# EAGLE board SniperBoard (EAGLE 6.4)
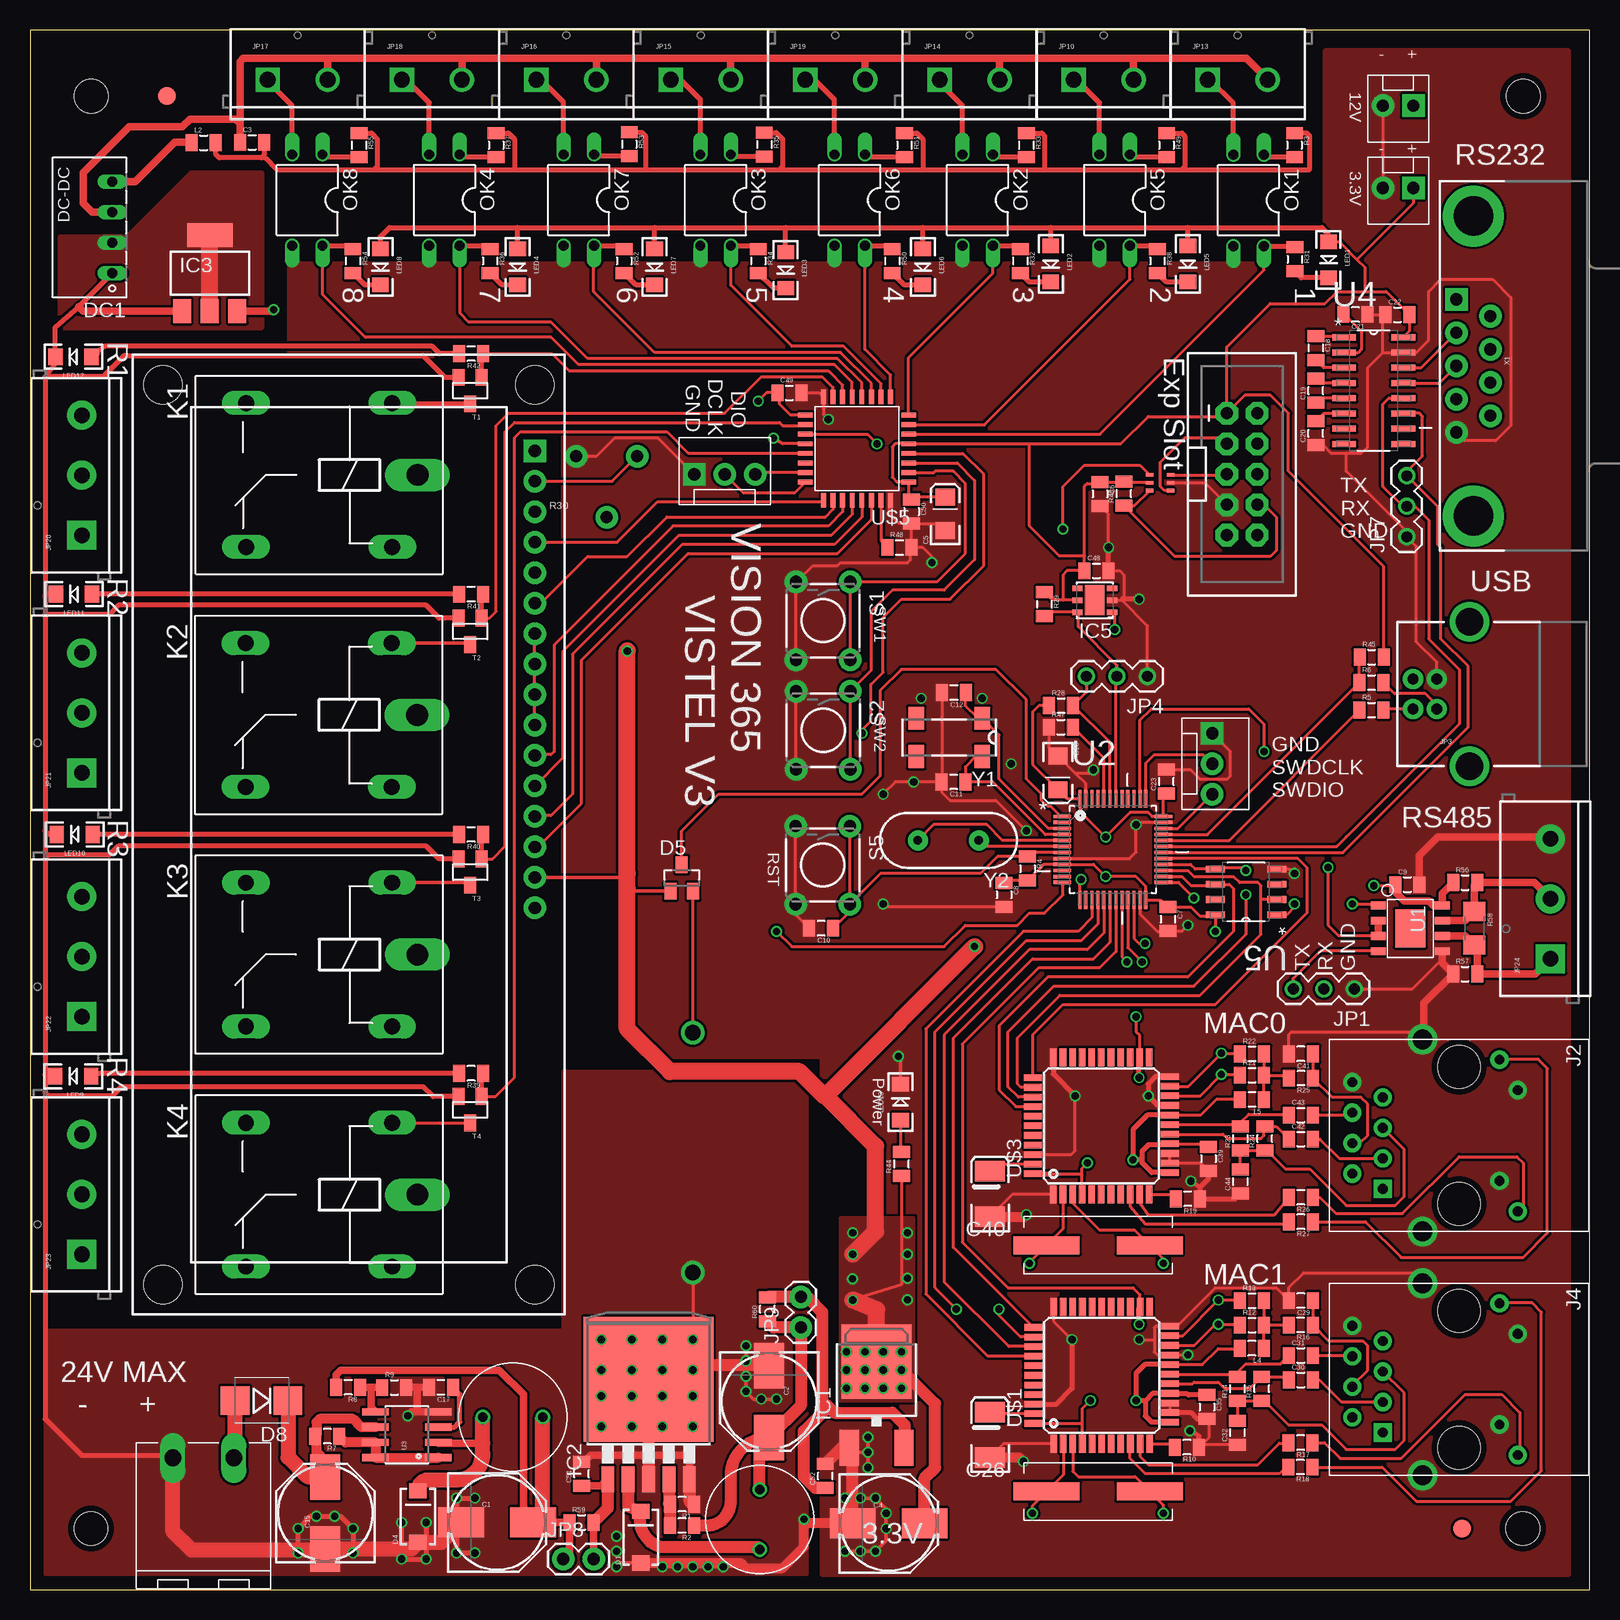
[diagram p5: board, top side]
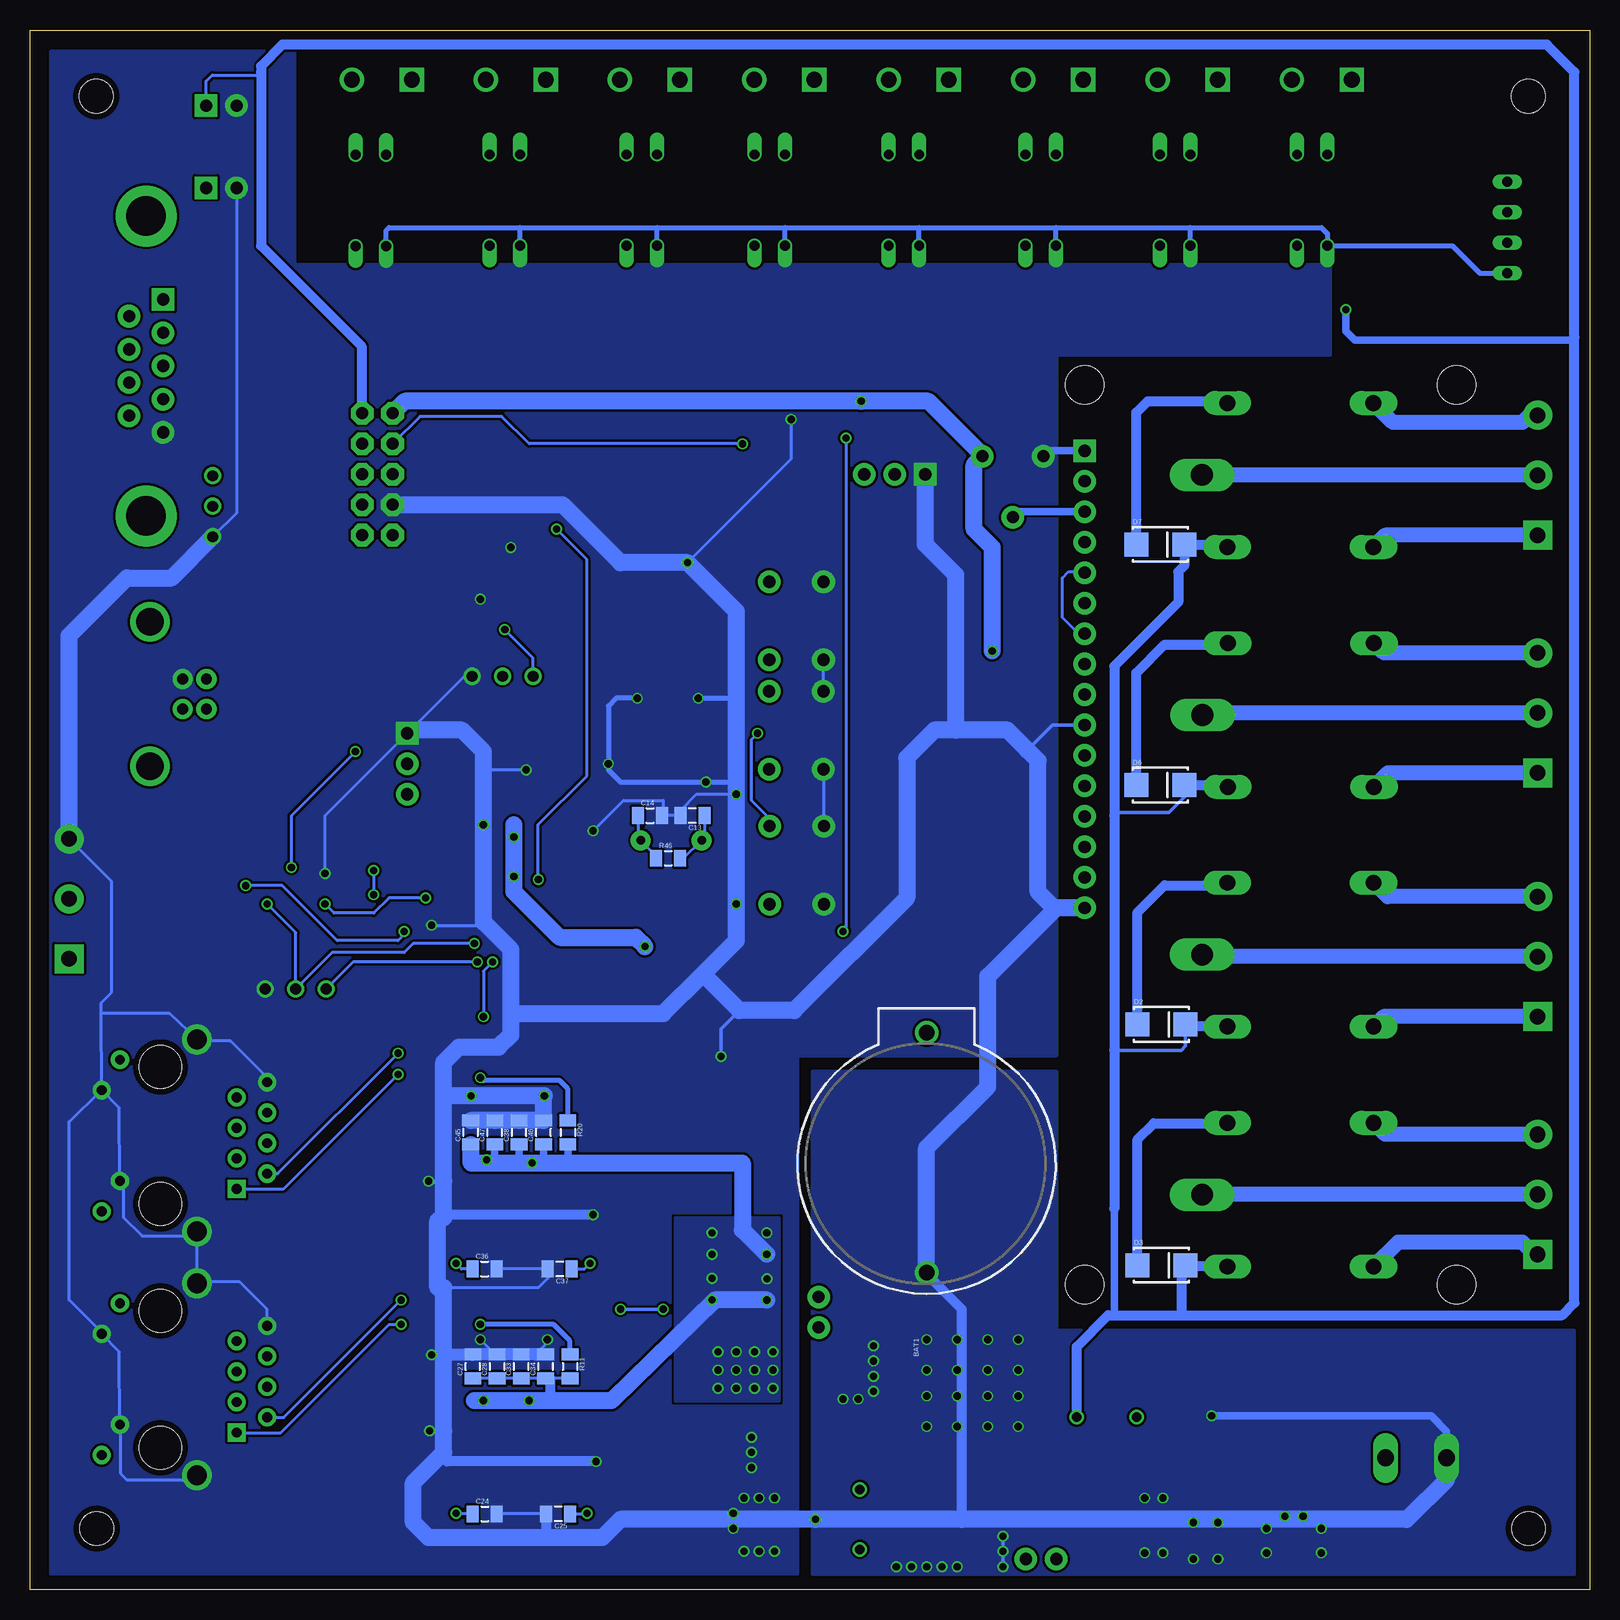
[diagram p6: board, bottom side, seen from below]

Size 130 x 130 mm. Coordinates in mm from the lower left corner, seen from the top.
Outline: 0,0 130,0 130,130 0,130 0,0
Copper layers (1*16): Top 0.035mm / dielectric 1.6mm / Bottom 0.035mm
Design rules "Elecrow_2-layer_PCB_eagle_rule *": minimum track width 8mil, minimum drill 12mil, track to track 8mil, track to pad 8mil, pad to pad 8mil, via to via 8mil, smd to smd 8mil, copper to edge 20mil, drill to drill 10mil, minimum pad ring 6mil, minimum via ring 6mil, stop-mask expansion 0mil, vias tented up to drill 100mil, thermal gap 10mil
Holes 2.8 mm at 5.1,124.49 124.47,124.49 124.43,5.08 5.08,5.08

## Footprints (pad centres in the part's own frame; a part is rotated, then mirrored left to right if it is on the bottom)
BATTCOM_20MM_PTH = drill 1.3: 1 20,0; 2 0,0
PANASONIC_E = smd 3.8 x 2.5: + 3,0; - -3,0
0805 = smd 1 x 1.4: 1 -1,0; 2 1,0
EIA3216 = smd 1.4 x 1.6: A 1.4,0; C -1.4,0
EIA3528-KIT = smd 1.7 x 2.5: A 1.9,0; C -1.9,0
SMA-DIODE = smd 1.27 x 1.47: A -2.15,0; C 2.15,0
SMA-DIODE_ALT = smd 2 x 2: A -2,0; C 2,0
SOT23 = smd 1 x 1.4: 1 -0.95,-1.1; 2 0.95,-1.1; 3 0,1.1
SMB-DIODE = smd 2.4 x 2.4: A 2.2,0; C -2.2,0
NME = drill 0.813 long: 1 0,3.81; 2 0,1.27; 3 0,-1.27; 4 0,-3.81
FIDUCIAL-1.5X3 = smd 1.5 x 1.5: 1 0,0
DPACK = smd 1.6 x 3: 1 -2.28,-4.8; 3 2.28,-4.8 | smd 5.8 x 6.2: 4 0,2.38
TO263-5 = smd 1.067 x 2.159: 1 -3.404,-5.791; 2 -1.702,-5.791; 3 0,-5.791; 4 1.702,-5.791; 5 3.404,-5.791 | smd 10.8 x 10.41: 6 0,2.54
SOT223 = smd 1.5 x 2: 1 -2.3,-3.15; 2 0,-3.15; 3 2.3,-3.15 | smd 3.8 x 2: 4 0,3.15
DFN6-3X3 = smd 0.85 x 0.45: 1 -1.45,1; 2 -1.45,0; 3 -1.45,-1; 4 1.45,-1; 5 1.45,0; 6 1.45,1 | smd 1.6 x 2.5: EXP 0,0
RJMG1BD3B8K1ANR = drill 0.813 pad 1.524: G+ 4.9,-6.32; G- 3.38,-3.78; GND -8.89,4.445; NC -6.35,3.175; P4 -8.89,-0.635; P5 -6.35,0.635; RD+ -6.35,-1.905; RD- -8.89,1.905; TD- -8.89,-3.175; Y+ 3.38,6.32; Y- 4.9,3.78 | drill 1.651 pad 2.159: SHIELD0 -3.05,8.001; SHIELD1 -3.05,-8.001 | drill 0.813 pad 1.524 square: TD+ -6.35,-4.445 | hole 3.556: 0,-5.715; 0,5.715
1X03 = drill 0.9 pad 1.422: 1 0,0; 2 2.54,0; 3 5.08,0
MOLEX-1X3 = drill 1.016 pad 1.88 square: 1 0,0 | drill 1.016 pad 1.88: 2 2.54,0; 3 5.08,0
USB-B-PTH = drill 0.914 pad 1.676: D+ 0,1.25; D- 1.981,1.25; GND 0,-1.25; VBUS 1.981,-1.25 | drill 2.286: S1 -2.718,-6.02; S2 -2.718,6.02
MOLEX-1X2 = drill 1.016 pad 1.88 square: 1 0,0 | drill 1.016 pad 1.88: 2 2.54,0
1X02 = drill 1.016 pad 1.88: 1 0,0; 2 2.54,0
SCREWTERMINAL-5MM-2 = drill 1.3 pad 2.032 square: 1 0,0 | drill 1.3 pad 2.032: 2 5,0
2X5-SHROUDED = drill 1.016 pad 1.88 octagon: 1 -1.27,5.08; 2 1.27,5.08; 3 -1.27,2.54; 4 1.27,2.54; 5 -1.27,0; 6 1.27,0; 7 -1.27,-2.54; 8 1.27,-2.54; 9 -1.27,-5.08; 10 1.27,-5.08
SCREWTERMINAL-5MM-3 = drill 1.3 pad 2.413 square: 1 0,0 | drill 1.3 pad 2.413: 2 5,0; 3 10,0
ZF112 = drill 1.321 long: 1 -6.096,5.994; 2 -6.096,-5.994; O 6.096,5.994; S 6.096,-5.994 | drill 1.803 long: P -8.204,0
RLB914-IND = drill 0.8: P$1 -2.5,0; P$2 2.5,0
LED-1206 = smd 1.2 x 1.4: A -1.5,0; C 1.5,0
DIL04 = drill 0.813 offset: 1 -1.27,-3.81; 2 1.27,-3.81; 3 1.27,3.81; 4 -1.27,3.81
TRIM_POT_PTH = drill 1 pad 1.88: 1 -2.54,-2.54; 2 0,2.54; 3 2.54,-2.54
1206 = smd 1.6 x 1.8: 1 -1.4,0; 2 1.4,0
TACTILE-PTH = drill 1.016 pad 1.88: 1 -3.251,2.261; 2 3.251,2.261; 3 -3.251,-2.261; 4 3.251,-2.261
SOP8 = smd 0.635 x 1.27: 1 -1.905,-2.667; 2 -0.635,-2.667; 3 0.635,-2.667; 4 1.905,-2.667; 5 1.905,2.667; 6 0.635,2.667; 7 -0.635,2.667; 8 -1.905,2.667 | smd 3.175 x 2.54: HEAT 0,0
QFP50P900X900X160-48N = smd 1.473 x 0.279: 1 -4.216,2.743; 2 -4.216,2.261; 3 -4.216,1.753; 4 -4.216,1.245; 5 -4.216,0.762; 6 -4.216,0.254; 7 -4.216,-0.254; 8 -4.216,-0.762; 9 -4.216,-1.245; 10 -4.216,-1.753; 11 -4.216,-2.261; 12 -4.216,-2.743; 25 4.216,-2.743; 26 4.216,-2.261; 27 4.216,-1.753; 28 4.216,-1.245; 29 4.216,-0.762; 30 4.216,-0.254; 31 4.216,0.254; 32 4.216,0.762; 33 4.216,1.245; 34 4.216,1.753; 35 4.216,2.261; 36 4.216,2.743 | smd 0.279 x 1.473: 13 -2.743,-4.216; 14 -2.261,-4.216; 15 -1.753,-4.216; 16 -1.245,-4.216; 17 -0.762,-4.216; 18 -0.254,-4.216; 19 0.254,-4.216; 20 0.762,-4.216; 21 1.245,-4.216; 22 1.753,-4.216; 23 2.261,-4.216; 24 2.743,-4.216; 37 2.743,4.216; 38 2.261,4.216; 39 1.753,4.216; 40 1.245,4.216; 41 0.762,4.216; 42 0.254,4.216; 43 -0.254,4.216; 44 -0.762,4.216; 45 -1.245,4.216; 46 -1.753,4.216; 47 -2.261,4.216; 48 -2.743,4.216
SO08 = smd 0.61 x 2.21: 1 -1.905,-2.616; 2 -0.635,-2.616; 3 0.635,-2.616; 4 1.905,-2.616; 5 1.905,2.616; 6 0.635,2.616; 7 -0.635,2.616; 8 -1.905,2.616
SOIC127P600X175-16N = smd 1.981 x 0.508: 1 -2.464,4.445; 2 -2.464,3.175; 3 -2.464,1.905; 4 -2.464,0.635; 5 -2.464,-0.635; 6 -2.464,-1.905; 7 -2.464,-3.175; 8 -2.464,-4.445; 9 2.464,-4.445; 10 2.464,-3.175; 11 2.464,-1.905; 12 2.464,-0.635; 13 2.464,0.635; 14 2.464,1.905; 15 2.464,3.175; 16 2.464,4.445
SOIC127P600X175-8N = smd 1.6 x 0.559: 1 -2.565,1.905; 2 -2.565,0.635; 3 -2.565,-0.635; 4 -2.565,-1.905; 5 2.565,-1.905; 6 2.565,-0.635; 7 2.565,0.635; 8 2.565,1.905
LCD-16X2 = drill 1.016 pad 1.88 square: 1 -32,15.5 | drill 1.016 pad 1.88: 2 -29.46,15.5; 3 -26.92,15.5; 4 -24.38,15.5; 5 -21.84,15.5; 6 -19.3,15.5; 7 -16.76,15.5; 8 -14.22,15.5; 9 -11.68,15.5; 10 -9.14,15.5; 11 -6.6,15.5; 12 -4.06,15.5; 13 -1.52,15.5; 14 1.02,15.5; 15 3.56,15.5; 16 6.1,15.5 | hole 3.2: -37.5,15.5; -37.5,-15.5; 37.5,15.5; 37.5,-15.5
TQFP-44 = smd 1.5 x 0.55: 1 -5.7,4; 2 -5.7,3.2; 3 -5.7,2.4; 4 -5.7,1.6; 5 -5.7,0.8; 6 -5.7,0; 7 -5.7,-0.8; 8 -5.7,-1.6; 9 -5.7,-2.4; 10 -5.7,-3.2; 11 -5.7,-4; 23 5.7,-4; 24 5.7,-3.2; 25 5.7,-2.4; 26 5.7,-1.6; 27 5.7,-0.8; 28 5.7,0; 29 5.7,0.8; 30 5.7,1.6; 31 5.7,2.4; 32 5.7,3.2; 33 5.7,4 | smd 0.55 x 1.5: 12 -3.9,-5.7; 13 -3.1,-5.7; 14 -2.3,-5.7; 15 -1.5,-5.7; 16 -0.7,-5.7; 17 0.1,-5.7; 18 0.9,-5.7; 19 1.7,-5.7; 20 2.5,-5.7; 21 3.3,-5.7; 22 4.1,-5.7; 34 4,5.7; 35 3.2,5.7; 36 2.4,5.7; 37 1.6,5.7; 38 0.8,5.7; 39 0,5.7; 40 -0.8,5.7; 41 -1.6,5.7; 42 -2.4,5.7; 43 -3.2,5.7; 44 -4,5.7
1X02_TERMB_RA = drill 1.4 long: P$1 0,2.54; P$2 0,-2.54
SC70-6 = smd 0.61 x 0.305: P$1 -0.85,0; P$2 0.9,0; P$3 0.9,-0.65; P$4 -0.85,-0.65; P$5 -0.85,-1.3; P$6 0.9,-1.3
LQFP32-7X7 = smd 1.2 x 0.4: 1 -4.3,2.8; 2 -4.3,2; 3 -4.3,1.2; 4 -4.3,0.4; 5 -4.3,-0.4; 6 -4.3,-1.2; 7 -4.3,-2; 8 -4.3,-2.8; 17 4.3,-2.8; 18 4.3,-2; 19 4.3,-1.2; 20 4.3,-0.4; 21 4.3,0.4; 22 4.3,1.2; 23 4.3,2; 24 4.3,2.8 | smd 0.4 x 1.2: 9 -2.8,-4.3; 10 -2,-4.3; 11 -1.2,-4.3; 12 -0.4,-4.3; 13 0.4,-4.3; 14 1.2,-4.3; 15 2,-4.3; 16 2.8,-4.3; 25 2.8,4.3; 26 2,4.3; 27 1.2,4.3; 28 0.4,4.3; 29 -0.4,4.3; 30 -1.2,4.3; 31 -2,4.3; 32 -2.8,4.3
DB9 = drill 1.016 pad 1.88 square: 1 -5.54,-1.42 | drill 1.016 pad 1.88: 2 -2.77,-1.42; 3 0,-1.42; 4 2.77,-1.42; 5 5.54,-1.42; 6 -4.15,1.42; 7 -1.38,1.42; 8 1.38,1.42; 9 4.15,1.42 | drill 3.302 pad 5.08: G1 -12.5,0; G2 12.5,0
MC-306 = smd 1.3 x 1.9: 1 -2.75,-1.6; 2 2.75,-1.6; 3 2.75,1.6; 4 -2.75,1.6
HC49US = drill 0.7 pad 1.651: 1 -2.54,0; 2 2.54,0
CRYSTAL-SMD-10.5X4.8-2PIN = smd 5.5 x 1.5: P$1 -4.3,0; P$2 4.3,0

## Placement (x,y rotation side)
BAT1  3V  [BATTCOM_20MM_PTH]  55.26,26.42 90 bottom
C1  100uF  [PANASONIC_E]  38.94,5.59 0 top
C2  470uF  [PANASONIC_E]  61.61,15.67 270 top
C3  0.1uF  [0805]  18.52,120.62 0 top
C4  470uF  [PANASONIC_E]  71.57,5.51 0 top
C5  10uF  [EIA3216]  76.28,89.66 90 top
C6  0.1uF  [0805]  89.2,91.33 270 top
C7  0.1uF  [0805]  94.85,55.88 270 top
C8  0.1uF  [0805]  81.2,57.91 270 top
C9  0.1uF  [0805]  114.81,58.76 0 top
C10  0.1uF  [0805]  65.96,55.12 180 top
C11  20pF  [0805]  77,67.31 180 top
C12  20pF  [0805]  77.03,74.76 180 top
C13  27pF  [0805]  74.79,64.51 180 bottom
C14  27pF  [0805]  78.32,64.52 0 bottom
C15  100uF  [PANASONIC_E]  24.62,6.39 90 top
C16  10uF  [EIA3216]  85.68,68.07 270 top
C17  220pF  [0805]  34.25,16.84 180 top
C18  0.1uF  [0805]  107.18,103.49 270 top
C19  0.1uF  [0805]  107.18,99.93 90 top
C20  0.1uF  [0805]  107.18,96.38 90 top
C21  0.1uF  [0805]  110.48,106.28 180 top
C22  0.1uF  [0805]  113.99,106.27 0 top
C23  0.1uF  [0805]  94.73,67.35 90 top
C24  27pF  [0805]  92.09,6.3 0 bottom
C25  27pF  [0805]  85.97,6.3 180 bottom
C26  10uF  [EIA3528-KIT]  80.02,12.91 90 top
C27  0.1uF  [0805]  93.08,18.59 90 bottom
C28  0.1uF  [0805]  91.05,18.59 90 bottom
C29  0.01uF  [0805]  105.94,24.08 180 top
C30  0.01uF  [0805]  105.94,17.47 0 top
C31  0.01uF  [0805]  105.94,19.5 0 top
C32  0.01uF  [0805]  100.65,13.08 90 top
C33  0.1uF  [0805]  89.05,18.59 90 bottom
C34  0.1uF  [0805]  87.02,18.59 90 bottom
C35  0.1uF  [0805]  98.11,15.21 270 top
C36  27pF  [0805]  92.1,26.72 0 bottom
C37  27pF  [0805]  85.84,26.72 180 bottom
C38  0.1uF  [0805]  89.23,38.1 90 bottom
C39  0.1uF  [0805]  98.24,35.91 270 top
C40  10uF  [EIA3528-KIT]  80.02,32.97 90 top
C41  0.01uF  [0805]  105.94,44.65 180 top
C42  0.01uF  [0805]  105.94,37.54 0 top
C43  0.01uF  [0805]  105.94,39.55 0 top
C44  0.01uF  [0805]  100.91,34.01 90 top
C45  0.1uF  [0805]  93.26,38.1 90 bottom
C46  0.1uF  [0805]  87.19,38.1 90 bottom
C47  0.1uF  [0805]  91.26,38.1 90 bottom
C48  0.1uF  [0805]  88.9,84.92 0 top
C49  0.1uF  [0805]  63.29,99.75 0 top
C50  0.1uF  [0805]  73.49,89.86 270 top
C51  0.1uF  [0805]  45.97,9.65 90 top
C52  0.1uF  [0805]  66.29,9.46 90 top
D1  SK34  [SMA-DIODE]  50.91,4.37 90 top
D2  1N4148WS-V-GS18  [SMA-DIODE_ALT]  35.68,47.1 0 bottom
D3  1N4148WS-V-GS18  [SMA-DIODE_ALT]  35.68,27.04 0 bottom
D4  SK34  [SMA-DIODE]  32.33,6.08 90 top
D5  BAS40-05  [SOT23]  54.33,59.32 0 top
D6  1N4148WS-V-GS18  [SMA-DIODE_ALT]  35.78,67.05 0 bottom
D7  1N4148WS-V-GS18  [SMA-DIODE_ALT]  35.78,87.12 0 bottom
D8  1N5819  [SMB-DIODE]  19.3,15.75 180 top
DC1  [NME]  6.86,113.54 180 top
FID1  FIDUCIAL1.5X3  [FIDUCIAL-1.5X3]  119.38,5.08 0 top
FID2  FIDUCIAL1.5X3  [FIDUCIAL-1.5X3]  11.41,124.49 0 top
IC1  LDL117S33  [DPACK]  70.56,16.62 0 top
IC2  LM2596S  [TO263-5]  51.56,14.99 0 top
IC3  LD117AS50TR  [SOT223]  14.99,109.73 0 top
IC5  SI7006-A10-IM  [DFN6-3X3]  88.76,82.47 180 top
J2  [RJMG1BD3B8K1ANR]  119.13,37.85 0 top
J4  [RJMG1BD3B8K1ANR]  119.13,17.53 0 top
JP1  [1X03]  110.39,50.06 180 top
JP2  [MOLEX-1X3]  55.37,92.96 0 top
JP3  USB-B  [USB-B-PTH]  117.27,74.66 180 top
JP4  [1X03]  93.15,76.12 180 top
JP5  [MOLEX-1X2]  115.32,123.7 180 top
JP6  [MOLEX-1X2]  115.32,116.84 180 top
JP7  [1X03]  114.77,87.76 90 top
JP8  [1X02]  44.45,2.54 0 top
JP9  [1X02]  64.26,21.84 90 top
JP10  [SCREWTERMINAL-5MM-2]  87,125.86 0 top
JP12  M05X2SHD  [2X5-SHROUDED]  101.04,92.97 0 top
JP13  [SCREWTERMINAL-5MM-2]  98.17,125.86 0 top
JP14  [SCREWTERMINAL-5MM-2]  75.82,125.86 0 top
JP15  [SCREWTERMINAL-5MM-2]  53.42,125.86 0 top
JP16  [SCREWTERMINAL-5MM-2]  42.21,125.86 0 top
JP17  [SCREWTERMINAL-5MM-2]  19.81,125.86 0 top
JP18  [SCREWTERMINAL-5MM-2]  31.01,125.86 0 top
JP19  [SCREWTERMINAL-5MM-2]  64.62,125.86 0 top
JP20  [SCREWTERMINAL-5MM-3]  4.32,87.88 90 top
JP21  [SCREWTERMINAL-5MM-3]  4.32,68.07 90 top
JP22  [SCREWTERMINAL-5MM-3]  4.32,47.75 90 top
JP23  [SCREWTERMINAL-5MM-3]  4.32,27.94 90 top
JP24  [SCREWTERMINAL-5MM-3]  126.75,52.58 90 top
JP25  [MOLEX-1X3]  98.55,71.37 270 top
K1  ZF112  [ZF112]  24.1,92.9 180 top
K2  ZF112  [ZF112]  24.06,72.9 180 top
K3  ZF112  [ZF112]  24.09,52.93 180 top
K4  ZF112  [ZF112]  24.09,32.91 180 top
L1  220uH  [RLB914-IND]  60.82,5.85 90 top
L2  10uH  [0805]  14.48,120.6 0 top
L3  220uH  [RLB914-IND]  40.24,14.37 0 top
L4  10uH  [0805]  101.85,20.11 180 top
L5  10uH  [0805]  101.87,40.84 180 top
LED1  Green  [LED-1206]  108.24,110.85 270 top
LED2  Green  [LED-1206]  85.09,110.49 270 top
LED3  Green  [LED-1206]  62.99,109.98 270 top
LED4  Green  [LED-1206]  40.64,110.24 270 top
LED5  Green  [LED-1206]  96.52,110.49 270 top
LED6  Green  [LED-1206]  74.42,110.24 270 top
LED7  Green  [LED-1206]  52.07,110.24 270 top
LED8  Green  [LED-1206]  29.21,110.24 270 top
LED9  Green  [LED-1206]  3.6,42.79 180 top
LED10  Green  [LED-1206]  3.73,62.95 180 top
LED11  Green  [LED-1206]  3.67,82.97 180 top
LED12  Green  [LED-1206]  3.61,102.76 180 top
LED13  Green  [LED-1206]  72.56,40.64 90 top
OK1  PC817  [DIL04]  101.57,115.8 180 top
OK2  PC817  [DIL04]  78.99,115.82 180 top
OK3  PC817  [DIL04]  57.15,115.82 180 top
OK4  PC817  [DIL04]  34.54,115.82 180 top
OK5  PC817  [DIL04]  90.42,115.82 180 top
OK6  PC817  [DIL04]  68.33,115.82 180 top
OK7  PC817  [DIL04]  45.75,115.82 180 top
OK8  PC817  [DIL04]  23.11,115.82 180 top
R1  1K  [0805]  54.36,7.11 180 top
R2  2.2K  [0805]  54.36,5.33 180 top
R3  470R  [0805]  105.41,120.4 270 top
R4  10K  [0805]  83.16,60.09 270 top
R5  22R  [0805]  111.83,73.31 0 top
R6  22R  [0805]  111.82,75.6 0 top
R7  0.68R  [0805]  24.78,12.78 180 top
R8  13K  [0805]  26.52,16.86 180 top
R9  1.5K  [0805]  30.37,16.84 0 top
R10  12.4K  [0805]  96.44,11.86 180 top
R11  100K  [0805]  84.98,18.59 270 bottom
R12  49.9R  [0805]  101.87,22.04 0 top
R13  49.9R  [0805]  101.87,24.08 0 top
R14  49.9R  [0805]  100.65,16.73 90 top
R15  49.9R  [0805]  102.67,16.74 90 top
R16  10R  [0805]  105.93,22.05 180 top
R17  470R  [0805]  105.91,12.24 180 top
R18  470R  [0805]  105.89,10.21 180 top
R19  12.4K  [0805]  96.51,32.56 180 top
R20  100K  [0805]  85.16,38.1 270 bottom
R21  49.9R  [0805]  101.87,42.87 0 top
R22  49.9R  [0805]  101.87,44.65 0 top
R23  49.9R  [0805]  100.91,37.59 90 top
R24  49.9R  [0805]  102.93,37.59 90 top
R25  10R  [0805]  105.95,42.62 180 top
R26  470R  [0805]  105.94,32.69 180 top
R27  470R  [0805]  105.94,30.66 180 top
R28  10K  [0805]  85.95,73.69 0 top
R29  10K  [0805]  84.56,82.13 270 top
R30  TRIMPOT 10K  [TRIM_POT_PTH]  48.07,91.92 180 top
R31  470R  [0805]  105.44,110.88 270 top
R32  470R  [0805]  82.55,110.74 270 top
R33  470R  [0805]  83.06,120.4 270 top
R34  470R  [0805]  60.71,110.74 270 top
R35  470R  [0805]  61.21,120.45 270 top
R36  470R  [0805]  38.35,110.74 270 top
R37  470R  [0805]  38.86,120.4 270 top
R38  470R  [0805]  93.98,110.74 270 top
R39  470R  [0805]  36.77,43.03 180 top
R40  470R  [0805]  36.77,62.94 180 top
R41  470R  [0805]  36.78,82.97 180 top
R42  470R  [0805]  36.78,103.02 180 top
R43  10K  [0805]  91.19,91.36 90 top
R44  470R  [0805]  72.64,35.48 90 top
R45  1.5K  [0805]  111.84,77.72 0 top
R46  1M  [0805]  76.79,60.96 0 bottom
R47  100K  [0805]  85.94,71.88 0 top
R48  100K  [0805]  72.47,86.87 0 top
R49  470R  [0805]  94.74,120.4 270 top
R50  470R  [0805]  71.88,110.74 270 top
R51  470R  [0805]  72.9,120.4 270 top
R52  470R  [0805]  49.53,110.74 270 top
R53  470R  [0805]  49.96,120.47 270 top
R54  470R  [0805]  26.92,110.74 270 top
R55  470R  [0805]  27.43,120.4 270 top
R56  10K  [0805]  119.63,58.93 0 top
R57  10K  [0805]  119.63,51.31 0 top
R58  120R  [1206]  120.4,55.12 270 top
R59  0  [0805]  45.97,5.59 0 top
R60  0  [0805]  61.47,23.37 90 top
S1  [TACTILE-PTH]  66.12,80.76 270 top
S2  [TACTILE-PTH]  66.12,71.63 270 top
S5  [TACTILE-PTH]  66.08,60.38 270 top
T1  MOSFET-NCHANNELBSS123LT1G  [SOT23]  36.7,99.94 180 top
T2  MOSFET-NCHANNELBSS123LT1G  [SOT23]  36.7,79.87 180 top
T3  MOSFET-NCHANNELBSS123LT1G  [SOT23]  36.7,59.8 180 top
T4  MOSFET-NCHANNELBSS123LT1G  [SOT23]  36.7,39.99 180 top
U1  MAX485  [SOP8]  115.06,55.12 270 top
U2  STM32F103CBT6  [QFP50P900X900X160-48N]  90.27,61.69 0 top
U3  MC34063SMD  [SO08]  31.41,12.9 90 top
U4  ST232CDR  [SOIC127P600X175-16N]  112,99.93 0 top
U5  S25FL004K0XMFI040  [SOIC127P600X175-8N]  101.37,58.15 180 top
U6  LCD-16X2SILK  [LCD-16X2]  26.58,62.92 270 top
U$1  ENC424J600  [TQFP-44]  89.33,17.85 90 top
U$2  1X02_TERMB_RA  [1X02_TERMB_RA]  14.46,10.97 270 top
U$3  ENC424J600  [TQFP-44]  89.3,38.66 90 top
U$4  NC7SP157  [SC70-6]  94.23,91.61 180 top
U$5  STM32F030K6T6  [LQFP32-7X7]  68.94,95.1 180 top
X1  [DB9]  120.32,102 270 top
Y1  32.768Khz  [MC-306]  76.63,71.03 180 top
Y2  8Mhz  [HC49US]  76.56,62.45 180 top
Y3  25Mhz  [CRYSTAL-SMD-10.5X4.8-2PIN]  89.05,8.18 180 top
Y4  25Mhz  [CRYSTAL-SMD-10.5X4.8-2PIN]  89.04,28.7 180 top

## Tracks (layer width: path | path; a pad name or v marks a point on that pad's centre or on a via)
3.3V  (via drill 0.6)
  Top 0.254: U$1.18 97.75,18.75 99.06,20.07 100.8,20.07 L4.2 | U$3.15 97.99,37.16 C39.1 | L5.2 98.88,40.84 97.6,39.56 U$3.18 | U$5.17 63.39,97.9 62.48,98.81 62.48,99.56 C49.1 61.4,99.75 v60.71,99.06 | U6.2 48.53,92.38 R30.1 | U4.16 114.99,104.9 C22.2 113.05,108.2 111.25,108.2 | C5.A 73.69,91.06 C50.1 73.24,91.11 U$5.1 72.29,92.3 71.88,92.71 71.88,95.25 72.13,95.5 U$5.5 83.31,95.5 | C8.1 81.37,59.09 R4.2 84.52,60.45 U2.9 88.65,60.45 v89.66,59.44 92.2,59.44 93.01,58.62 U2.24 94.26,57.47 C7.1 96.79,56.88 97.54,56.13 98.69,56.13 U5.8 | 98.68,56.12 U5.8 | C23.1 94.49,66.11 U2.36 93.56,64.43 93.22,64.77 91.69,64.77 v89.66,62.74 87.53,64.87 U2.48 86.45,65.91 C16.A 83.57,68.79 83.57,73.15 84.11,73.69 R28.1 | IC5.5 86.11,82.47 | 86.11,82.47 85.22,82.47 R29.1 | 83.31,95.5 90.93,95.5 93.22,97.79 99.51,97.79 JP12.1 | U$4.P$3 91.28,92.26 R43.2 91.16,92.33 C6.1 89.07,92.2 88.14,92.2 87.9,91.96 87.9,86.15 | JP12.1 99.77,103.58 103.38,107.19 107.95,107.19 108.97,108.2 111.25,108.2 | LED1.A 109.14,112.35 110.62,110.87 | 110.62,110.87 111.25,110.24 111.25,108.2 | U5.8 v98.8,54.87 v98.81,54.86 | v112.01,58.67 113.72,58.67 C9.1 | R45.2 112.84,85.28 104.9,93.22 104.9,98.04 103.38,99.57 101.28,99.57 JP12.1 | R44.1 72.64,25.4 v68.58,24.13 | U$1.4 87.73,13.97 | 87.73,13.97 87.73,15.08 v88.39,15.75 | U$1.44 87.61,13.85 87.73,13.97 | U$3.4 87.7,34.54 | 87.7,34.54 87.7,35.12 v88.14,35.56 | 84.95,34.66 87.59,34.66 87.7,34.54 | 87.9,86.15 C48.1 86.44,84.92 86.11,84.58 86.11,82.47 | 87.9,86.15 85.81,86.15 83.31,88.65 83.31,95.5 | JP6.1 115.32,115.57 110.62,110.87
  Top 0.305: D5.1 49.99,58.22 49.78,58.42 | U6.15 49.46,59.36 49.78,59.69
  Top 0.406: 92.96,15.75 93.57,16.35 U$1.15 96.42,16.35 96.57,16.21 C35.1 | 92.96,15.75 92.96,14.48 93.47,13.97 95.01,13.97 U$1.12 | 92.96,15.75 v92.2,15.75 92.2,18.03 92.92,18.75 U$1.18 | U$3.44 84.95,34.66 | U$3.12 93.51,34.76 92.71,35.56 92.71,35.81 | 92.71,35.81 92.71,36.55 C45.1 94.94,37.1 U$3.15 | 92.71,35.81 v91.95,35.81 91.95,38.35 93.15,39.56 U$3.18 | LED8.A 29.21,112.78 29.97,113.54 40.64,113.54 | 40.64,113.54 52.07,113.54 | 52.07,113.54 62.99,113.54 | 62.99,113.54 74.42,113.54 | 74.42,113.54 85.09,113.54 | 85.09,113.54 96.52,113.54 | 96.52,113.54 107.7,113.54 108.2,113.03 108.2,112.39 LED1.A | LED5.A 96.52,113.54 | LED2.A 85.09,113.54 | LED6.A 74.42,113.54 | LED3.A 62.99,113.54 | LED7.A 52.07,113.54 | LED4.A 40.64,113.54
  Top 0.61: R56.1 117.73,58.02 U1.8 116.97,57.02 116.59,57.4 114.55,57.4 113.79,58.17 113.79,58.74 C9.1
  Top 1.016: C4.+ 74.57,9.29 75.44,10.16 75.44,15.49 v72.64,18.29 71.37,19.56 71.12,19.56 IC1.4
  Top 1.422: IC1.4 70.56,23.32 v68.58,24.13 | v78.74,53.59 66.29,41.15 | v49.78,78.23 49.78,59.69 49.78,58.42 49.78,46.74 53.34,43.18 64.14,43.18 66.17,41.15 66.29,41.15 | v68.58,27.94 70.48,29.84 70.48,36.96 66.29,41.15
  Bottom 0.254: R11.2 86.64,17.59 C34.1 C33.1 C28.1 C27.1 | v98.81,54.86 98.81,54.61 99.31,54.1 104.39,54.1 108.97,58.67 v112.01,58.67
  Bottom 0.406: 92.96,15.75 91.19,15.75 | 93.26,35.6 92.75,35.6 92.71,35.56 | v91.95,35.81 91.44,35.81 | 91.19,35.81 91.44,35.81 | 91.44,35.81 91.69,35.56
  Bottom 0.61: R20.2 85.16,35.63 85.09,35.56 | C46.1 87.19,35.63 87.12,35.56 | C38.1 89.23,35.63 89.15,35.56 | C47.1 91.26,35.74 91.44,35.56
  Bottom 0.813: 86.64,17.59 86.64,15.97 86.87,15.75
  Bottom 1.422: v68.58,24.13 72.9,24.13 81.53,15.75 86.87,15.75 v88.39,15.75 91.19,15.75 v92.2,15.75 92.96,15.75 | C45.1 93.26,35.6 93.22,35.56 92.71,35.56 91.69,35.56 91.44,35.56 89.15,35.56 v88.14,35.56 87.12,35.56 85.09,35.56 70.61,35.56 70.61,29.97 v68.58,27.94 | JP12.1 98.76,99.06 v60.71,99.06 55.12,99.06 50.61,94.55 R30.1 51.31,93.76 51.31,88.39 49.78,86.87 v49.78,78.23 | 89.66,63.75 v89.66,62.74 v89.66,59.44 89.66,58.17 85.85,54.36 79.5,54.36 v78.74,53.59
  other vias: 68.07,19.81 69.6,19.81 71.12,19.81 72.64,19.81 68.07,18.29 69.6,18.29 71.12,18.29 68.07,16.76 69.6,16.76 71.12,16.76 72.64,16.76 73.15,27.94 73.15,25.93 68.55,25.91 73.15,24.16 68.58,29.72 73.15,29.72
  pour Bottom (no thermals): 67.56,30.99 67.56,15.75 76.2,15.75 76.2,30.99
  pour Top (no thermals): 67.56,30.99 67.56,15.75 73.66,15.75 73.66,30.99
232_RX
  Top 0.254: U4.13 117.47,100.57 X1.3
232_TX
  Top 0.254: U4.14 115.97,101.84 X1.2
+5V
  Top 1.016: L1.P$2 60.82,11.88 arc-90 C2.+ | R2.1 56.39,5.33 arc90 58.42,7.37 58.42,9.48 arc-90 C2.+ | C2.+ 64.26,15.32 JP9.1 61.99,21.84 R60.1
+12V  (via drill 0.6)
  Top 0.61: R8.2 25.52,17.9 25.91,18.29 39.12,18.29 41.15,16.26 41.15,6.38 C1.+ R59.1 | 44.96,5.6 R59.1 | R59.1 44.97,3.06 JP8.1 | IC3.3 20.22,106.58 v20.32,106.68
  Top 1.27: C1.+ arc90 42.74,6.39 L3.P$2
  Bottom 0.254: JP5.1 115.32,125.73 114.81,126.24 111,126.24 110.74,126.49
  Bottom 0.305: D6.C 33.78,66.04 35.05,64.77 39.37,64.77 39.62,64.52 | D2.C 33.68,45.31 34.04,44.96 39.62,44.96
  Bottom 0.61: v20.32,106.68 20.32,104.9 19.56,104.14 1.52,104.14 1.27,104.39 | 39.62,31.75 39.62,22.86
  Bottom 0.813: K4.1 33.56,26.92 D3.C 34.04,26.68 34.04,22.86 | K3.1 33.51,46.93 D2.C | D6.C 30.31,67.05 K2.1 | K1.1 30.41,87.12 D7.C 33.78,85.35 34.29,84.84 34.29,82.3 39.62,76.96 39.62,64.52 39.62,44.96 39.62,31.75 | 34.04,22.86 2.29,22.86 1.27,23.88 1.27,104.39 1.27,126.49 3.56,128.78 108.97,128.78 110.74,127 110.74,126.49 110.74,112.01 102.36,103.63 102.36,98.11 JP12.2 | L3.P$2 42.74,20.25 40.13,22.86 39.62,22.86 34.04,22.86
BOOT0
  Top 0.254: U2.44 89.51,69.31 R47.2
DAISY_MUX
  Top 0.254: U$4.P$5 99.71,92.91 JP12.5
DAISY_RX0  (via drill 0.6)
  Top 0.254: U2.13 87.53,59.08 v87.63,59.18 | v86.11,88.39 86.11,91.95 87.88,93.73 92.52,93.73 U$4.P$6
  Bottom 0.254: v87.63,59.18 87.63,63.75 83.57,67.82 83.57,85.85 v86.11,88.39
DAISY_RX1  (via drill 0.6)
  Top 0.254: U$5.20 62.74,95.5 v61.98,95.99 | v62.23,54.86 63.5,53.59 76.2,53.59 77.98,55.37 82.3,55.37 83.31,56.39 84.58,56.39 86.11,57.91 86.11,58.89 U2.12
  Bottom 0.254: v61.98,95.99 61.98,55.12 v62.23,54.86
DAISY_RX2  (via drill 0.6)
  Top 0.254: U$5.19 69.81,96.3 v70.61,95.5 | U$4.P$1 94.57,91.61 94.23,91.95 94.23,93.98 96.27,96.01 99.27,96.01 JP12.3
  Bottom 0.254: v70.61,95.5 88.39,95.5 90.68,97.79 97.49,97.79 JP12.3
DI_0
  Top 0.254: U$5.6 89.19,96.3 102.87,109.98 102.87,111.96 OK1.4
  Top 0.406: OK1.4 105.33,111.99 R31.1
DI_1
  Top 0.254: U$5.7 79.58,97.1 91.69,109.22 OK5.4
  Top 0.406: OK5.4 93.71,112.01 R38.1
DI_2
  Top 0.254: U$5.8 73.24,102.7 80.26,109.73 OK2.4
  Top 0.406: OK2.4 82.28,112.01 R32.1
DI_3
  Top 0.254: U$5.9 71.74,101.24 69.6,103.38 OK6.4
  Top 0.406: OK6.4 71.61,112.01 R50.1
DI_4
  Top 0.254: U$5.10 70.94,100.51 67.82,103.63 63.5,103.63 58.42,108.71 OK3.4
  Top 0.406: OK3.4 60.44,112.01 R34.1
DI_5
  Top 0.254: U$5.11 70.14,100.55 67.56,103.12 52.07,103.12 46.99,108.2 46.99,111.99 OK7.4
  Top 0.406: OK7.4 49.26,112.01 R52.1
DI_6
  Top 0.254: OK4.4 35.81,106.43 36.58,105.66 43.43,105.66 46.48,102.62 67.31,102.62 69.34,100.59 U$5.12
  Top 0.406: OK4.4 38.08,112.01 R36.1
DI_7
  Top 0.254: U$5.13 68.54,100.63 67.06,102.11 45.72,102.11 43.43,104.39 27.94,104.39 24.38,107.95 OK8.4
  Top 0.406: OK8.4 26.65,112.01 R54.1
DO_0
  Top 0.254: T1.1 37.9,101.04 | U$5.14 67.74,100.41 66.67,101.47 66.55,101.6 44.96,101.6 43.54,103.02 R42.1
  Top 0.406: T1.1 37.65,102.89 R42.1
DO_1
  Top 0.254: T2.1 38.3,80.97 38.86,81.53 38.86,97.03 39.88,98.04 57.91,98.04 60.96,101.09 66.04,101.09 66.94,100.19 U$5.15
  Top 0.406: T2.1 37.65,82.83 R41.1
DO_2
  Top 0.254: T3.1 38.55,60.9 39.62,61.98 39.62,96.52 40.39,97.28 62.48,97.28 62.74,97.03 64.56,97.03 U$5.18
  Top 0.406: T3.1 37.65,62.81 R40.1
DO_3
  Top 0.254: T4.1 38.81,41.09 40.39,42.67 40.39,96.01 40.89,96.52 53.09,96.52 54.86,94.74 64.6,94.74 U$5.21
  Top 0.406: T4.1 37.65,42.91 R39.1
EINT0  (via drill 0.6)
  Top 0.254: U2.19 90.52,53.19 89.15,51.82 84.07,51.82 77.72,45.47 77.72,28.96 81.53,25.15 91.95,25.15 92.53,24.57 U$1.24
  Top 0.406: v92.46,22.1 92.46,23.48 U$1.24
  Bottom 0.406: R11.1 84.98,20.72 86.36,22.1 v92.46,22.1
EINT1  (via drill 0.6)
  Top 0.254: U2.20 91.03,52.73 v91.44,52.32 | v92.2,47.75 92.2,46.48 92.5,46.18 U$3.24
  Top 0.406: v92.46,42.67 92.46,44.31 U$3.24
  Bottom 0.254: v91.44,52.32 92.2,51.56 v92.2,47.75
  Bottom 0.406: R20.1 85.16,41.73 85.85,42.42 92.2,42.42 v92.46,42.67
G_RESET  (via drill 0.6)
  Top 0.254: U2.7 83.51,61.44 R4.1 80.65,61.09 79.25,59.69 70.9,59.69 S5.2 | S5.2 S5.1 | S5.2 68.34,56.51 C10.1 | U$5.4 77.76,94.7 79.5,92.96 79.5,85.34 76.71,82.55 72.64,82.55 71.12,81.03 71.12,76.45 70.1,75.44 70.1,72.39 69.34,71.63 v69.34,71.37
  Bottom 0.254: S5.1 68.34,64.28 69.85,65.79 69.85,70.87 v69.34,71.37
GND  (via drill 0.6)
  Top 0.254: U$1.14 U$1.13 | U$1.22 95.61,21.95 98.81,25.15 103.88,25.15 C29.2 104.94,25.19 106.17,26.42 115.32,26.42 J4.SHIELD0 | C35.2 98.3,14.03 98.3,12.7 97.46,11.86 R10.1 97.66,12.08 C32.1 | U$3.14 U$3.13 97.59,35.56 C39.2 | v96.52,19.56 v96.52,19.55 U$1.19 93.98,19.56 93.73,19.81 93.73,20.83 | U$3.1 81.9,32.96 C40.C | C49.2 65.79,99.75 U$5.16 66.14,97.95 v66.55,97.54 | U$5.32 71.63,90.69 71.63,89.66 72.43,88.86 C50.2 73.47,88.84 | R30.3 47.22,94.46 48.77,96.01 52.32,96.01 JP2.1 | U6.10 U6.9 U6.8 U6.7 | R48.2 73.47,88.84 | C21.1 112.97,106.28 C22.1 112.78,106.05 112.78,103.12 | 109.73,94.74 108.46,94.74 107.82,95.38 C20.1 106.93,95.13 | 109.73,94.74 111,94.74 111.51,95.25 111.51,101.85 112.78,103.12 | 112.78,103.12 114.45,103.12 U4.15 115.56,103.11 116.59,104.14 116.59,108.2 117.6,109.22 121.92,109.22 123.44,107.7 123.44,97.03 122.17,95.76 119.6,95.76 X1.5 | 109.73,94.74 109.73,93.22 114.77,88.18 JP7.1 115.57,86.95 115.57,78.99 117.27,77.29 JP3.GND | 73.47,88.84 75.7,88.84 C5.C | C12.2 76.03,67.35 C11.2 | C11.2 76,66.5 76.71,65.79 80.52,65.79 v83.06,63.25 | 87.12,68.07 85.72,69.47 C16.C 84.94,70.22 R47.1 | 87.12,68.07 88.01,67.19 U2.47 | U2.23 92.53,56.31 93.98,54.86 94.84,54.86 C7.2 96.03,54.88 v96.52,55.37 | S5.3 S5.4 63.82,56.25 C10.2 | S2.4 S2.3 | S1.4 S1.3 63.94,84.01 65.28,85.34 67.31,85.34 67.56,85.6 73.15,85.6 73.41,85.85 73.41,86.8 R48.2 | U2.35 92.4,63.95 v92.2,63.75 92.2,61.47 91.66,60.93 U2.8 | C23.2 96.75,68.35 97.54,67.56 99.82,67.56 100.08,67.82 100.08,69.85 JP25.1 | JP4.1 93.15,80.33 91.01,82.47 90.93,82.47 | IC5.2 90.93,82.47 | U5.4 105.05,60.05 v105.41,59.69
  Top 0.254: C8.2 71.36,56.91 v71.12,57.15 | C11.2 72.14,67.31 v71.12,66.29 | v75.18,85.6 75.18,86.11 74.42,86.87 R48.2 | C6.2 89.9,89.63 C48.2 90.85,84.92 91.19,84.58 91.19,82.73 91.1,82.64 90.93,82.47 | U$4.P$4 97.94,92.26 JP12.7 99.83,90.43 | BAT1.2 55.26,20.83 55.26,20.59 53.34,18.67 | 87.12,68.07 88.39,68.07 v88.65,68.33 | C41.2 104.94,46.27 105.16,46.48 115.57,46.48 J2.SHIELD0 | U$3.42 86.8,36.26 87.12,36.58 v87.12,41.15 | U$1.1 81.17,12.15 C26.C | 94.09,21.95 93.83,21.95 93.73,21.84 93.73,20.83 | v92.46,20.83 93.73,20.83 | U$1.33 85.33,22.37 v86.87,20.83 | JP1.1 115.21,50.06 117.73,52.58 | JP5.2 JP6.2
  Top 0.305: LED13.C 72.56,44.28 v72.39,44.45 | v48.9,1.91 49.21,2.22 D1.A 52.39,2.22 v52.7,1.91 v53.98,1.91 v55.24,1.91 v56.52,1.91 v57.78,1.91 | v62.23,15.88 v60.96,15.88 60.33,15.88 v59.69,16.51 v59.69,17.78 v59.69,19.05 | v59.69,19.05 v59.69,20.32 | v59.69,19.05 60.58,19.05 60.96,18.67 | v47.62,20.83 v50.16,20.83 v52.7,20.83 v55.24,20.83 v55.24,18.29 v52.7,18.29 | 51.56,17.53 50.93,17.53 v50.16,18.29 v47.62,18.29 v47.62,16.13 v50.16,16.13 v52.7,16.13 v55.24,16.13 v55.24,13.59 | v55.24,13.59 55.24,13.34 | v55.24,13.59 v52.7,13.59 | v50.16,13.59 50.16,13.34 | v67.94,3.17 v69.22,3.17 v70.48,3.17 71.37,4.06 v71.37,5.08 v71.37,6.35 71.37,6.73 v70.48,7.62 v69.22,7.62 v67.94,7.62 67.94,6.14 C4.- | v69.85,11.43 68.68,11.43 IC1.1 | v69.85,12.7 v69.85,11.43 | v69.85,11.43 v69.85,10.16
  Top 0.406: U$1.13 96.75,14.75 97.28,14.22 98.1,14.22 C35.2 | 95.61,21.95 94.09,21.95 | U$3.22 93.81,42.76 93.22,42.16 v93.22,41.15 94.01,40.36 U$3.19 | C44.1 100.46,32.56 R19.1 97.54,32.58 97.54,33.53 | C39.2 98.24,34.23 97.54,33.53 | U$3.33 85.3,42.97 v87.12,41.15 | R10.1 97.44,12.8 v96.7,13.23 | 97.54,33.53 v96.77,34.04 | 1.27,101.09 2.11,102.19 LED12.C 2.11,105.24 4.06,106.93 DC1.1 | 1.27,101.09 1.27,82.8 | 1.27,82.8 1.27,81.28 | 1.27,81.28 1.27,63.25 | 1.27,63.25 1.27,60.96 | 1.27,60.96 1.27,42.93 | 1.27,42.93 1.27,41.4 | 1.27,41.4 1.27,14.22 4.32,11.18 11.71,11.18 U$2.P$2 | LED9.C 1.41,42.79 1.27,42.93 | LED10.C 1.57,62.95 1.27,63.25 | LED11.C 1.44,82.97 1.27,82.8 | T4.2 33.58,41.09 32.77,41.91 7.62,41.91 6.86,41.15 1.52,41.15 1.27,41.4 | T3.2 34.09,60.9 33.02,61.98 7.37,61.98 6.6,61.21 1.52,61.21 1.27,60.96 | T2.2 34.09,80.97 33.02,82.04 7.37,82.04 6.6,81.28 1.27,81.28 | 1.27,101.09 6.1,101.09 7.87,102.87 32.77,102.87 34.6,101.04 T1.2 | 24.13,3.3 23.88,3.05 v22.35,3.05 v22.35,5.08 23.37,6.1 v23.88,6.1 v25.4,6.1 25.91,6.1 v26.92,5.08 v26.92,3.05 | v30.99,2.54 v30.99,5.59 | v33.02,5.59 v33.02,2.54 v30.99,2.54 | v30.99,2.54 30.99,2.58 D4.A | v37.08,7.62 v35.56,7.62 v35.56,3.05 | v35.56,3.05 v37.08,3.05 | v35.56,3.05 35.56,5.21 C1.- | v47.62,16.13 v47.62,13.59 | 50.16,13.34 50.67,13.34 51.56,12.45 | U$1.42 85.56,15.45 86.87,16.76 v86.87,20.83 | C48.2 89.9,86.85 v89.92,86.87 | v92.46,82.55 91.19,82.55 91.1,82.64
  Top 0.61: R9.2 32.27,16.84 | 32.27,16.84 C17.2 | U3.4 32.26,14.81 | 32.26,14.81 31.82,14.81 v31.5,14.48 | 32.27,16.84 32.27,14.82 32.26,14.81 | C51.2 46.21,10.65 46.74,11.18 51.05,11.18 51.18,11.05 | 51.18,11.05 51.56,10.67 IC2.3 | IC2.5 54.97,11.07 54.86,11.18 51.31,11.18 51.18,11.05 | C9.2 115.81,61.2 117.35,62.74 126.59,62.74 JP24.3 | U1.5 117.73,52.58 117.73,52.21 R57.1 116.2,48.88 116.2,45.98 J2.SHIELD0 | IC3.1 4.42,106.58 4.06,106.93
  Top 0.813: C26.C 82.47,11.01 v82.8,10.67 | C40.C 82.89,31.07 v83.06,31.24 | C4.- 64.85,5.51 v64.52,5.84 64.52,3.56 62.74,1.78 59.69,1.78 59.25,2.22 D1.A
  Top 1.016: IC2.5 54.97,7.5 arc90 R1.1 | IC2.3 51.56,12.45 51.56,17.53 52.07,18.03 52.32,18.03 52.96,18.67 53.34,18.67 60.96,18.67 C2.- | C52.2 67.65,11.82 IC1.1 68.57,11.54 C4.-
  Top 1.27: C1.- 34.28,3.93 D4.A 31.79,3.39 C15.- 24.54,3.3 24.13,3.3 13.46,3.3 11.92,4.85 U$2.P$2 | v55.24,20.83 55.26,20.83
  Bottom 0.254: J2.Y- 122.56,40.13 J2.G- 122.17,33.66 122.17,30.99 120.65,29.46 116.59,29.46 J2.SHIELD1 J4.SHIELD0 116.08,25.65 112.52,25.65 110.24,23.37 J4.GND | C25.2 C24.2 | 93.11,19.56 C27.2 | C36.2 C37.2 86.84,25.93 87.63,25.15 95.5,25.15 | U6.7 42.6,79.68 43.94,81.03 43.94,84.33 43.43,84.84 42.15,84.84 U6.5 | v83.06,63.25 80.52,65.79 77.22,65.79 77.22,64.62 C14.2 C13.2 75.79,64.93 74.42,66.29 v71.12,66.29 | v96.52,55.37 92.46,55.37 92.2,55.63 | v105.41,59.69 105.41,64.52 JP25.1 93.8,76.12 JP4.1 | S5.3 63.82,68.34 S2.4 | S2.3 63.86,77.5 S1.4 | v66.55,97.54 66.55,94.23 v75.18,85.6 | JP24.3 123.19,59.02 123.19,49.78 124.08,48.9 124.08,48.01 | v88.65,68.33 91.95,68.33 92.2,68.58 | J2.GND 110.24,42.67 113.28,45.72 116.08,45.72 J2.SHIELD0 118.36,48.01 124.08,48.01 | J2.Y- 124.08,48.01 | J2.Y- 126.75,38.99 126.75,24.13 124.08,21.46 J4.Y- 122.56,19.81 J4.G- 122.43,13.59 122.43,9.65 121.92,9.14 116.59,9.14 J4.SHIELD1 | C28.2 91.22,19.59 v92.46,20.83 | v86.87,20.83 86.87,20.61 87.88,19.59 | JP6.2 112.78,89.75 JP7.1
  Bottom 0.305: U6.10 44.78,72.06 46.86,69.98 | v72.39,44.45 72.39,46.74 70.87,48.26 | v48.9,4.45 v48.9,3.17 v48.9,1.91
  Bottom 0.406: v96.7,13.23 95.5,13.21 | v96.77,34.04 95.5,34.04 | OK1.3 100.31,113.31 100.08,113.54 89.15,113.54 | 89.15,113.54 77.72,113.54 | 77.72,113.54 67.06,113.54 | 67.06,113.54 55.88,113.54 | 55.88,113.54 44.45,113.54 | 44.45,113.54 33.27,113.54 | 33.27,113.54 22.35,113.54 21.84,113.03 OK8.3 11.43,112.01 9.14,109.73 DC1.1 | OK4.3 33.27,113.54 | OK7.3 44.48,113.51 44.45,113.54 | OK3.3 55.88,113.54 | OK6.3 67.06,113.54 | OK2.3 77.72,113.54 | OK5.3 89.15,113.54 | 71.12,67.56 71.37,67.31 v73.66,67.31 80.77,67.31 81.79,68.33 v81.79,68.83 81.79,73.66 81.15,74.3 v79.38,74.3 | v74.3,74.3 71.5,74.3 71.12,74.68
  Bottom 0.61: v31.5,14.48 13.21,14.48 11.94,13.21 11.94,10.99 U$2.P$2 | U6.1 45.07,94.92 R30.3
  Bottom 0.813: v82.8,10.67 95.25,10.67 95.76,11.18 | v83.06,31.24 95.25,31.24 95.5,30.99 | C25.2 86.97,4.42 86.87,4.32 | 52.32,5.84 52.32,23.37 55.37,26.42
  Bottom 1.016: C34.2 87.88,19.59 C33.2 C28.2 C27.2 | 93.11,19.56 95.75,19.56 95.76,19.55 95.76,19.56 95.5,19.81
  Bottom 1.422: 95.5,41.15 95.5,34.04 95.5,30.99 96.01,30.73 96.01,25.15 95.5,25.15 95.5,19.81 95.5,13.21 95.5,11.43 95.76,11.18 98.04,8.89 98.04,5.59 96.77,4.32 86.87,4.32 82.3,4.32 80.77,5.84 v64.52,5.84 52.32,5.84 15.24,5.84 11.92,9.17 U$2.P$2 | 95.5,41.15 v93.22,41.15 v87.12,41.15 87.19,41.08 C46.2 C38.2 C47.2 C45.2 | 95.5,41.15 95.5,43.94 94.23,45.21 90.93,45.21 89.92,46.23 89.92,48.01 | 89.92,48.01 89.92,53.34 92.2,55.63 v92.2,63.75 92.2,68.58 92.2,69.85 93.98,71.63 98.3,71.63 JP25.1 | 89.92,48.01 77.22,48.01 73.91,51.31 | 73.91,51.31 71.12,54.1 v71.12,57.15 v71.12,66.29 71.12,67.56 71.12,74.68 71.12,81.53 v75.18,85.6 80.77,85.6 85.61,90.43 JP12.7 | U6.16 44.45,56.82 | 44.45,56.82 44.63,56.82 45.97,58.17 45.97,69.09 46.86,69.98 48.51,71.63 52.83,71.63 | 52.83,71.63 54.61,71.63 56.9,69.34 56.9,57.66 66.29,48.26 70.87,48.26 73.91,51.31 | 52.83,71.63 52.83,84.58 55.37,87.12 JP2.1 | JP7.1 118.19,84.33 121.92,84.33 126.75,79.5 JP24.3 | BAT1.2 55.26,36.82 50.16,41.91 50.16,51.11 44.45,56.82
  pour Bottom (no thermals): 1.27,21.59 1.27,1.27 64.77,1.27 64.77,43.18 44.45,43.18 44.45,21.59
  pour Top (no thermals): 1.27,21.59 1.27,1.27 64.77,1.27 64.77,43.18 44.45,43.18 44.45,21.59
  pour Bottom (rank 6, no thermals): 66.04,1.27 128.27,1.27 128.27,128.27 107.95,128.27 107.95,110.49 21.59,110.49 21.59,102.87 44.45,102.87 44.45,44.45 66.04,44.45
  pour Top (rank 6, no thermals): 107.95,110.49 21.59,110.49 21.59,102.87 44.45,102.87 44.45,44.45 66.04,44.45 66.04,1.27 128.27,1.27 128.27,128.27 107.95,128.27
I2C1_SCL
  Top 0.254: R29.2 84.9,81.47 IC5.6 87.38,81.4 87.38,80.26 90.61,77.03 JP4.2 90.52,76.04 U2.42
I2C1_SDA  (via drill 0.6)
  Top 0.254: U2.43 90.02,70.63 R28.2 88.07,74.81 JP4.3 | v90.42,80.01 90.42,81.25 IC5.1
  Bottom 0.254: JP4.3 88.07,77.66 v90.42,80.01
LA1
  Top 0.254: R17.1 107.9,12.24 109.22,10.92 114.3,10.92 119.63,16.26 122.68,16.26 124.21,14.73 124.21,11.05 J4.G+
LA2
  Top 0.254: R26.1 107.52,32.69 108.86,31.34 114.4,31.34 119.13,36.07 123.95,36.07 124.46,35.56 124.46,31.62 J2.G+
LB1
  Top 0.254: R18.1 112.73,10.21 115.57,7.37 123.44,7.37 125.98,9.91 125.98,23.11 125.22,23.88 122.54,23.88 J4.Y+
LB2
  Top 0.254: R27.1 111.33,30.66 114.3,27.69 124.46,27.69 126.49,29.72 126.49,43.43 125.73,44.2 122.54,44.2 J2.Y+
LCD_D4
  Top 0.254: U$5.27 67.74,89.84 66.55,88.65 53.59,88.65 43.69,78.74 43.69,69.85 43.43,69.6 42.15,69.6 U6.11
LCD_D5
  Top 0.254: U6.12 42.09,66.98 44.45,69.34 44.45,78.23 54.1,87.88 66.8,87.88 68.58,89.66 68.58,90.76 U$5.28
LCD_D6
  Top 0.254: U$5.29 69.34,89.4 67.06,87.12 54.36,87.12 45.21,77.98 45.21,66.29 43.43,64.52 42.15,64.52 U6.13
LCD_D7
  Top 0.254: U6.14 42.35,61.9 45.97,65.53 45.97,77.47 54.86,86.36 67.31,86.36 70.14,89.19 U$5.30
LCD_E
  Top 0.254: U6.6 42.6,82.22 46.48,86.11 49.78,86.11 53.09,89.41 66.29,89.41 66.94,90.05 U$5.26
LCD_RS
  Top 0.254: U6.4 48.95,87.3 52.32,90.68 66.01,90.68 U$5.25
N$1
  Bottom 1.27: JP20.2 32.29,92.88 K1.P
N$2
  Top 0.406: LED1.C 105.97,109.35 R31.2
N$3
  Top 0.254: BAT1.1 55.26,50.57 D5.2
N$4
  Top 1.016: IC2.4 53.26,7.2 arc90 R1.2 R2.2
N$5
  Top 1.016: IC2.2 49.86,6.93 D1.C 50.91,6.5 arc90 52.58,3.56 60.61,3.56 arc-90 L1.P$1
N$6
  Top 0.61: JP24.1 125.48,51.31 R57.2 120.63,53.48 R58.2 119.63,54.48 U1.6
N$7
  Top 0.254: U2.6 79.6,61.94 Y2.1
  Bottom 0.254: R46.1 77.79,61.15 Y2.1 79.32,62.67 C14.1
N$8
  Top 0.254: LED13.A 72.56,36.56 R44.2
N$9
  Top 0.406: R33.2 80.5,119.4 OK2.1
N$10
  Top 0.254: JP3.D- 112.93,73.41 R5.2
N$11
  Top 0.254: JP3.D+ 117.27,73.74 116.33,74.68 113.75,74.68 R6.2
N$12
  Bottom 0.61: U6.3 47.61,89.84 R30.2
N$13
  Bottom 1.27: JP23.1 4.57,27.94 5.59,28.96 15.96,28.96 K4.O
N$14
  Top 0.254: U2.3 84.89,63.44 80.77,67.56 80.77,71.23 Y1.1 79.01,72.63 77.98,73.66 77.98,74.71 C12.1
N$15
  Top 0.254: U2.4 84.64,62.94 80.26,67.31 C11.1 77.98,67.33 77.98,68.58 78.83,69.43 Y1.4
N$16
  Top 0.254: U2.5 81.06,62.45 79.76,63.75 75.32,63.75 Y2.2
  Bottom 0.254: R46.2 75.51,60.96 Y2.2 73.79,62.68 C13.1
N$17
  Top 0.254: U$5.31 70.94,87.4 R48.1
N$18
  Top 0.406: R3.2 103.06,119.4 OK1.1
N$19
  Top 0.406: OK1.2 100.31,123.93 98.37,125.86 JP13.1
N$20
  Top 0.406: OK2.2 77.72,123.7 75.82,125.6 JP14.1
N$21
  Bottom 1.27: JP23.3 17.03,37.94 K4.S
N$22
  Top 0.406: U3.3 35.38,13.54 35.81,13.97 35.81,16.28 C17.1
N$23
  Top 0.406: LED2.C 83.3,108.99 R32.2
N$24
  Top 0.61: U3.2 arc90 34.1,12.19 37.74,12.19
  Top 1.27: D4.C arc-90 33.25,9.14 35.56,9.14 arc90 37.74,11.33 37.74,12.19 L3.P$1
N$25
  Top 0.61: R8.1 28.42,16.86 | 28.42,16.86 29.35,16.86 R9.1 | 28.42,16.86 28.42,15.18 U3.5
N$26
  Top 0.254: C21.2 109.62,106.28 111,104.9 111,103.38 110.73,103.11 U4.2
N$27
  Top 0.254: U4.6 107.83,98.03 C20.2
N$28
  Top 0.254: U4.3 107.83,101.84 C18.2
N$29
  Top 0.254: C18.1 109.43,104.49 U4.1
N$30
  Top 0.254: U4.5 107.54,99.3 C19.1
N$31
  Top 0.254: U4.4 107.54,100.57 C19.2
N$32
  Top 0.61: JP24.2 125.4,58.93 R56.2 120.4,58.69 R58.1 119.63,55.75 U1.7
N$33  (via drill 0.6)
  Top 0.254: U$1.3 86.93,9.85 87.38,9.4 92.13,9.4 Y3.P$1 94.49,7.04 v94.49,6.35
  Bottom 0.254: C24.1 94.43,6.3 v94.49,6.35
N$34
  Top 0.254: U$3.43 80.6,35.46 C40.A
N$35  (via drill 0.6)
  Top 0.254: U$3.2 86.1,30.05 Y4.P$2 83.31,27.27 v83.31,27.18
  Bottom 0.254: C37.1 83.77,26.72 v83.31,27.18
N$36
  Top 0.254: U$1.16 96.91,17.15 97.03,17.27 99.06,17.27 99.57,16.76 101.7,16.76 R15.2 104.67,17.74 C30.1
N$37
  Top 0.254: U$1.43 80.17,14.65 C26.A
N$38
  Top 0.254: U$1.17 100.44,17.95 R14.2 100.65,18.1 101.35,18.8 104.23,18.8 C31.1
N$39
  Top 0.254: U$3.11 95.11,32.96 R19.2
N$40  (via drill 0.6)
  Top 0.254: U$1.2 86.13,9.55 Y3.P$2 83.57,6.99 v83.57,6.35
  Bottom 0.254: C25.1 83.62,6.3 v83.57,6.35
N$41
  Top 0.254: U$1.11 95.15,12.15 R10.2
N$42
  Top 0.61: DC1.4 8.76,117.35 12.06,120.65 13.43,120.65 L2.1
N$43
  Top 0.254: U$1.10 92.53,11.11 93.22,10.41 102.36,10.41 104.14,12.19 104.87,12.19 R17.2
N$44
  Top 0.254: R18.2 104.7,10.21 104.14,9.65 92.96,9.65 91.69,10.92 91.69,12.12 U$1.9
N$45
  Top 0.254: R13.2 R12.2 | R12.2 R16.2 | L4.1 102.85,22.02 R12.2
N$46
  Top 1.422: 14.99,106.58 IC3.4
  pour Top (no thermals): 2.54,112.78 8.13,112.78 13.46,118.11 19.3,118.11 19.3,105.16 2.54,105.16
N$47  (via drill 0.6)
  Top 0.254: U$3.3 86.9,32.23 89.15,29.97 92.07,29.97 Y4.P$1 94.49,27.56 v94.49,27.18
  Bottom 0.254: C36.1 94.03,26.72 v94.49,27.18
N$48
  Top 0.254: U$3.16 99.46,37.96 99.82,37.59 102.62,37.59 102.87,37.85 102.87,38.54 R24.2 103.88,38.59 C42.1
N$49
  Top 0.254: U$3.17 100.74,38.76 R23.2 100.91,38.93 101.6,39.62 104.86,39.62 C43.1
N$50
  Top 0.254: R22.2 R21.2 | R21.2 104.7,42.87 R25.2 | L5.1 R21.2
N$51
  Top 0.254: U$3.10 92.5,32.21 93.22,31.24 103.75,31.24 R26.2
N$52
  Top 0.254: U$3.9 91.7,32 92.96,30.48 104.61,30.48 R27.2
N$53
  Bottom 1.27: JP22.3 16.83,57.75 K3.S
N$54
  Bottom 1.27: JP21.2 32.1,73.07 K2.P
N$55
  Bottom 1.27: JP22.1 17.17,47.75 K3.O
N$56
  Bottom 1.27: JP21.1 16.8,68.07 K2.O
N$57
  Bottom 1.27: JP21.3 17.15,78.07 K2.S
N$58
  Bottom 1.27: JP22.2 32.12,52.75 K3.P
N$59
  Bottom 1.27: JP20.1 17.03,87.88 K1.O
N$60
  Bottom 1.27: JP23.2 32.27,32.94 K4.P
N$61
  Bottom 1.27: JP20.3 4.99,97.88 5.59,97.28 16.39,97.28 K1.S
N$62
  Top 0.254: 30.26,98.84 K1.2
  Top 0.406: 30.26,98.84 T1.3
  Bottom 0.813: D7.A 37.78,98.11 36.83,99.06 30.36,99.06 K1.2
N$63
  Top 0.305: K2.2 36.57,78.89 T2.3
  Bottom 0.813: D6.A 37.78,76.42 35.43,78.77 30.29,78.77 K2.2
N$64
  Top 0.305: K3.2 36.48,58.92 T3.3
  Bottom 0.813: D2.A 37.68,56.45 35.43,58.7 30.4,58.7 K3.2
N$65
  Top 0.254: 36.67,38.86 30.23,38.86 K4.2
  Top 0.305: 36.67,38.86 T4.3
  Bottom 0.406: 36.32,38.86 35.46,38.86 35.43,38.89
  Bottom 0.813: D3.A 37.68,37.5 36.32,38.86 30.23,38.86 K4.2
N$66
  Top 0.406: 5.63,103.02 LED12.A 6.24,103.63 33.53,103.63 34.14,103.02 R42.2
N$67
  Top 0.406: R41.2 5.68,82.97 LED11.A
N$68
  Top 1.27: U$2.P$1 17.1,10.97 D8.A
N$69
  Top 0.254: U$5.23 60.59,93.1 JP2.3
N$70
  Top 0.406: R40.2 5.75,62.94 LED10.A
N$71
  Top 0.254: JP2.2 59.44,91.44 63.78,91.44 U$5.24
N$72
  Top 0.406: R39.2 5.86,43.03 LED9.A
N$73
  Top 0.406: R35.2 58.61,119.45 OK3.1
N$74
  Top 0.406: OK3.2 55.88,124.21 54.23,125.86 JP15.1
N$75
  Top 0.406: LED3.C 61.97,108.48 R34.2
N$77
  Top 0.254: U$4.P$2 92.08,90.36 R43.1 95.44,86.11 103.38,86.11 103.89,86.61 103.89,89.41 102.86,90.43 JP12.8
N$78
  Top 0.406: R37.2 36.05,119.4 OK4.1
N$79
  Top 0.406: OK4.2 33.27,123.95 31.37,125.86 JP18.1
N$80
  Top 0.406: LED4.C 39.36,108.74 R36.2
N$82
  Top 0.406: R49.2 91.93,119.4 OK5.1
N$83
  Top 0.406: OK5.2 89.15,123.95 87.25,125.86 JP10.1
N$84
  Top 0.406: LED5.C 94.73,108.99 R38.2
N$86
  Top 0.406: R51.2 69.83,119.4 OK6.1
N$87
  Top 0.406: OK6.2 67.06,124.21 65.41,125.86 JP19.1
N$88
  Top 0.406: LED6.C 72.89,108.74 R50.2
N$90
  Top 0.406: R53.2 47.18,119.47 OK7.1
N$91
  Top 0.406: OK7.2 44.48,123.98 42.6,125.86 JP16.1
N$92
  Top 0.406: LED7.C 50.54,108.74 R52.2
N$93
  Top 1.016: R60.2 61.48,24.38 JP9.2 64.77,24.38 66.04,23.11 66.04,15.75 66.55,15.24 | 66.55,15.24 67.06,14.73 71.88,14.73 72.9,13.72 72.9,11.88 IC1.3 | C52.1 65.45,8.46 64.52,9.4 64.52,13.21 66.55,15.24
N$94
  Top 0.406: R55.2 24.62,119.4 OK8.1
N$95
  Top 0.406: OK8.2 21.84,123.7 19.81,125.73 JP17.1
N$96
  Top 0.406: LED8.C 27.93,108.74 R54.2
N$98
  Top 0.61: R59.2 46.97,2.56 JP8.2 | C51.1 47.62,8.65 IC2.1
  Top 1.016: IC2.1 48.16,6.77 R59.2
RS485EN  (via drill 0.6)
  Top 0.254: v108.2,60.2 108.2,55.37 108.23,55.37 108.23,55.35 109.09,54.48 U1.3 | U2.38 92.53,72.47 93.47,73.41 101.6,73.41 102.87,72.14 v102.87,69.85
  Top 0.61: U1.3 U1.2
  Bottom 0.254: v108.2,60.2 108.2,64.52 v102.87,69.85
RX1+
  Top 0.254: C30.2 107.5,17.47 109.35,15.62 J4.RD+
RX1-
  Top 0.254: C31.2 110.16,19.5 J4.RD-
RX1_CT
  Top 0.254: C32.2 R14.1 R15.1 102.88,15.74 104.9,13.72 107.7,13.72 109.73,11.68 113.79,11.68 114.55,12.45 114.55,16.38 J4.P5
RX2+
  Top 0.254: C42.2 107.52,37.54 109.14,35.94 J2.RD+
RX2-
  Top 0.254: C43.2 110.03,39.55 J2.RD-
RX2_CT
  Top 0.254: C44.2 R23.1 R24.1 103.11,36.59 104.65,35.05 106.68,35.05 109.73,32 113.79,32 114.55,32.77 114.55,36.7 J2.P5
SPI1_MISO  (via drill 0.6)
  Top 0.254: U2.16 89.03,55.5 87.63,54.1 83.06,54.1 75.44,46.48 75.44,25.15 v77.22,23.37 | U$1.35 82.58,21.05 80.77,22.86 v80.77,23.37
  Bottom 0.305: v80.77,23.37 v77.22,23.37
SPI1_MOSI
  Top 0.254: U2.17 89.51,54.71 88.14,53.34 83.31,53.34 76.2,46.23 76.2,25.65 81.6,20.25 U$1.36
SPI1_SCK
  Top 0.254: U2.15 88.52,56.01 87.38,54.86 82.8,54.86 74.68,46.74 74.68,24.64 79.86,19.45 U$1.37
SPI1_SS1_ETH1
  Top 0.254: U2.18 90.02,53.95 88.65,52.58 83.57,52.58 76.96,45.97 76.96,28.52 U$1.34
SPI2_MISO
  Top 0.254: U$3.35 82.6,41.86 82.3,42.16 82.3,45.97 85.85,49.53 97.54,49.53 102.62,54.61 102.62,57.45 | 102.62,57.45 102.62,58.67 102.36,58.93 100.84,58.93 100.33,59.44 97.03,59.44 96.53,59.94 U2.27 | 103.82,57.4 U5.2 102.67,57.51 102.62,57.45
SPI2_MOSI  (via drill 0.6)
  Top 0.254: U2.28 96.75,60.45 97.14,60.05 U5.5 98.95,60.2 101.09,60.2 v101.35,59.94 | U$3.36 82.39,41.06 81.53,41.91 81.53,46.48 85.34,50.29 97.03,50.29 101.35,54.61 v101.35,57.91
  Bottom 0.254: v101.35,59.94 v101.35,57.91
SPI2_SCK
  Top 0.254: 98.29,58.67 98.3,58.67 | 98.3,58.67 98.69,58.67 U5.6 99.97,58.78 100.33,58.42 100.33,54.86 96.52,51.05 84.84,51.05 80.77,46.99 80.77,41.66 82.17,40.26 U$3.37 83.44,40.26 83.31,40.39 | U2.26 96.02,59.43 96.77,58.67 98.3,58.67
SPI2_SS1_ETH2
  Top 0.254: U$3.34 83.6,46.26 86.11,48.77 98.81,48.77 106.43,56.39 106.43,60.2 105.66,60.96 94.52,60.96 U2.29
SPI2_SS2_FLASH  (via drill 0.6)
  Top 0.254: 103.89,56.2 U5.1 104.76,56.24 105.41,56.9 v105.41,57.15 | U2.25 95.74,58.95 v97.03,57.66
  Bottom 0.254: v97.03,57.66 100.08,57.66 101.35,56.39 104.65,56.39 v105.41,57.15
SW0
  Top 0.254: S1.2 S1.1 75.62,84.01 77.98,86.36 77.98,92.2 76.96,93.22 75.44,93.22 75.32,93.1 U$5.2
SW1
  Top 0.254: S2.2 S2.1 70.1,76.6 70.1,81.53 71.88,83.31 76.2,83.31 78.74,85.85 78.74,92.46 77.29,93.9 U$5.3
SWDCLK
  Top 0.254: U2.37 93.01,68.88 93.73,69.6 97.79,69.6 JP25.2
SWDIO
  Top 0.254: U2.34 95.7,63.44 JP25.3
TX1+  (via drill 0.6)
  Top 0.254: U$1.20 97.06,20.35 98.81,22.1 v99.06,22.1 100.82,22.1 R12.1
  Bottom 0.254: J4.TD+ 109.09,13.08 100.08,22.1 v99.06,22.1
TX1-  (via drill 0.6)
  Top 0.254: U$1.21 96.08,21.15 v99.06,24.13 100.82,24.13 R13.1
  Bottom 0.254: J4.TD- 108.84,14.35 v99.06,24.13
TX1_CT
  Top 0.254: C29.1 106.94,22.07 R16.1 108.28,20.7 111.12,20.7 111.51,20.32 111.51,18.29 110.24,17.02 J4.P4
TX2+  (via drill 0.6)
  Top 0.254: R21.1 100.82,42.93 v99.31,42.93 97.55,41.16 U$3.20
  Bottom 0.254: J2.TD+ 108.84,33.4 v99.31,42.93
TX2-  (via drill 0.6)
  Top 0.254: R22.1 100.82,44.7 v99.31,44.7 96.57,41.96 U$3.21
  Bottom 0.254: J2.TD- 109.35,34.67 v99.31,44.7
TX2_CT
  Top 0.254: C41.1 106.94,42.64 R25.1 108.55,41.02 110.95,41.02 111.51,40.46 111.51,37.85 110.87,37.21 J2.P4
UART_RX1  (via drill 0.6)
  Top 0.254: U2.22 92.02,54.28 92.46,53.85 v92.96,53.85 | v110.24,57.15 112.27,57.15 U1.1
  Bottom 0.254: v92.96,53.85 98.04,53.85 98.81,53.09 104.83,53.09 JP1.2 107.85,54.76 v110.24,57.15
UART_RX2
  Top 0.254: U4.12 114.45,99.31 113.28,99.31 112.78,98.81 112.78,91.95 114.43,90.3 JP7.2 115.44,90.3 116.59,89.15 116.59,79.25 119.13,76.71 119.13,72.14 110.11,63.12 109.73,62.74 108.93,61.94 U2.31
UART_TX1  (via drill 0.6)
  Top 0.254: U2.21 91.52,53.52 v92.71,52.32 | JP1.3 105.31,50.95 107.57,53.21 U1.4
  Bottom 0.254: v92.71,52.32 103.05,52.32 JP1.3
UART_TX2
  Top 0.254: U4.11 114.48,98.04 115.82,98.04 116.08,97.79 116.08,94.49 114.77,93.17 JP7.3 117.35,90.25 117.35,87.12 117.6,86.87 117.6,79.25 119.89,76.96 119.89,71.88 109.44,61.44 U2.30
USB_D+
  Top 0.254: U2.33 98.15,62.94 R6.1 110.82,77.7 R45.1
USB_D-
  Top 0.254: U2.32 99.97,62.45 R5.1
VBAT
  Top 0.254: D5.3 54.33,63.22 57.4,66.29 69.34,66.29 70.87,67.82 70.87,74.93 72.64,76.71 80.52,76.71 83.06,74.17 83.06,67.56 84.33,66.29 84.33,65.79 84.84,65.28 85.09,65.28 85.94,64.43 U2.1
VCOM
  Top 0.61: DC1.3 5.21,114.81 4.45,115.57 4.45,118.11 8.26,121.92 12.7,121.92 13.34,122.56 17.14,122.56 17.52,122.18 | C3.1 17.52,122.18 | 17.52,122.18 17.52,127.37 17.78,127.64 24.77,127.64 | 24.77,127.64 36.2,127.64 | 36.2,127.64 46.99,127.64 | 46.99,127.64 58.42,127.64 | 58.42,127.64 69.85,127.64 | 69.85,127.64 80.64,127.64 | 80.64,127.64 92.08,127.64 | 92.08,127.64 101.39,127.64 JP13.2 | JP10.2 92,127.56 92.08,127.64 | JP14.2 80.82,127.46 80.64,127.64 | JP19.2 69.62,127.4 69.85,127.64 | JP15.2 58.42,127.63 58.42,127.64 | JP16.2 47.22,127.41 46.99,127.64 | JP17.2 24.81,127.59 24.77,127.64 | JP18.2 36.01,127.45 36.2,127.64
VIN
  Top 0.406: 28.7,118.36 20.57,118.36 19.6,119.34 19.3,119.34 | 28.7,118.36 40.39,118.36 | 40.39,118.36 51.31,118.36 | 51.31,118.36 62.48,118.36 | 62.48,118.36 74.42,118.36 | 74.42,118.36 84.58,118.36 | 84.58,118.36 96.01,118.36 | 96.01,118.36 106.68,118.36 106.68,121.16 106.43,121.41 105.43,121.41 R3.1 | R49.1 96.03,121.4 96.27,121.16 96.27,118.62 96.01,118.36 | R33.1 84.34,121.4 84.58,121.16 84.58,118.36 | R51.1 73.93,121.4 74.42,120.9 74.42,118.36 | R35.1 62.2,121.45 62.74,120.9 62.74,118.62 62.48,118.36 | R53.1 50.99,121.47 51.31,121.16 51.31,118.36 | R37.1 39.89,121.4 40.39,120.9 40.39,118.36 | R55.1 28.46,121.4 28.96,120.9 28.96,118.62 28.7,118.36 | 19.3,119.34 15.79,119.34 15.49,119.63 15.49,120.58 L2.2 | C3.2 19.52,119.55 19.3,119.34
VIN1
  Top 0.813: U3.6 27.61,13.54 26.92,14.22 24.13,14.22 23.88,13.97 23.88,12.87 R7.2 23.88,12.68 23.88,11.43 24.62,10.68 C15.+
  Top 1.27: D8.C 21.5,11.01 23.11,9.4 C15.+
VIN2
  Top 0.813: R7.1 26.29,12.27 U3.7 U3.8 U3.1

## Text on the board
tPlace: - + | 12V | - + | RS232 | 3.3V | 8 | 7 | 6 | 5 | 4 | 3 | 2 | 1 | R1 | Exp Slot | DIO / DCLK / GND | VISION 365 / VISTEL V3 | TX / RX / GND | R2 | USB | SW1 | SW2 | GND / SWDCLK / SWDIO | R3 | RS485 | RST | TX / RX / GND | MAC0 | R4 | Power | MAC1 | 24V MAX / - + | 3.3V